# EAGLE design TouScruino-avr-ui2-v0 (EAGLE 6.3)
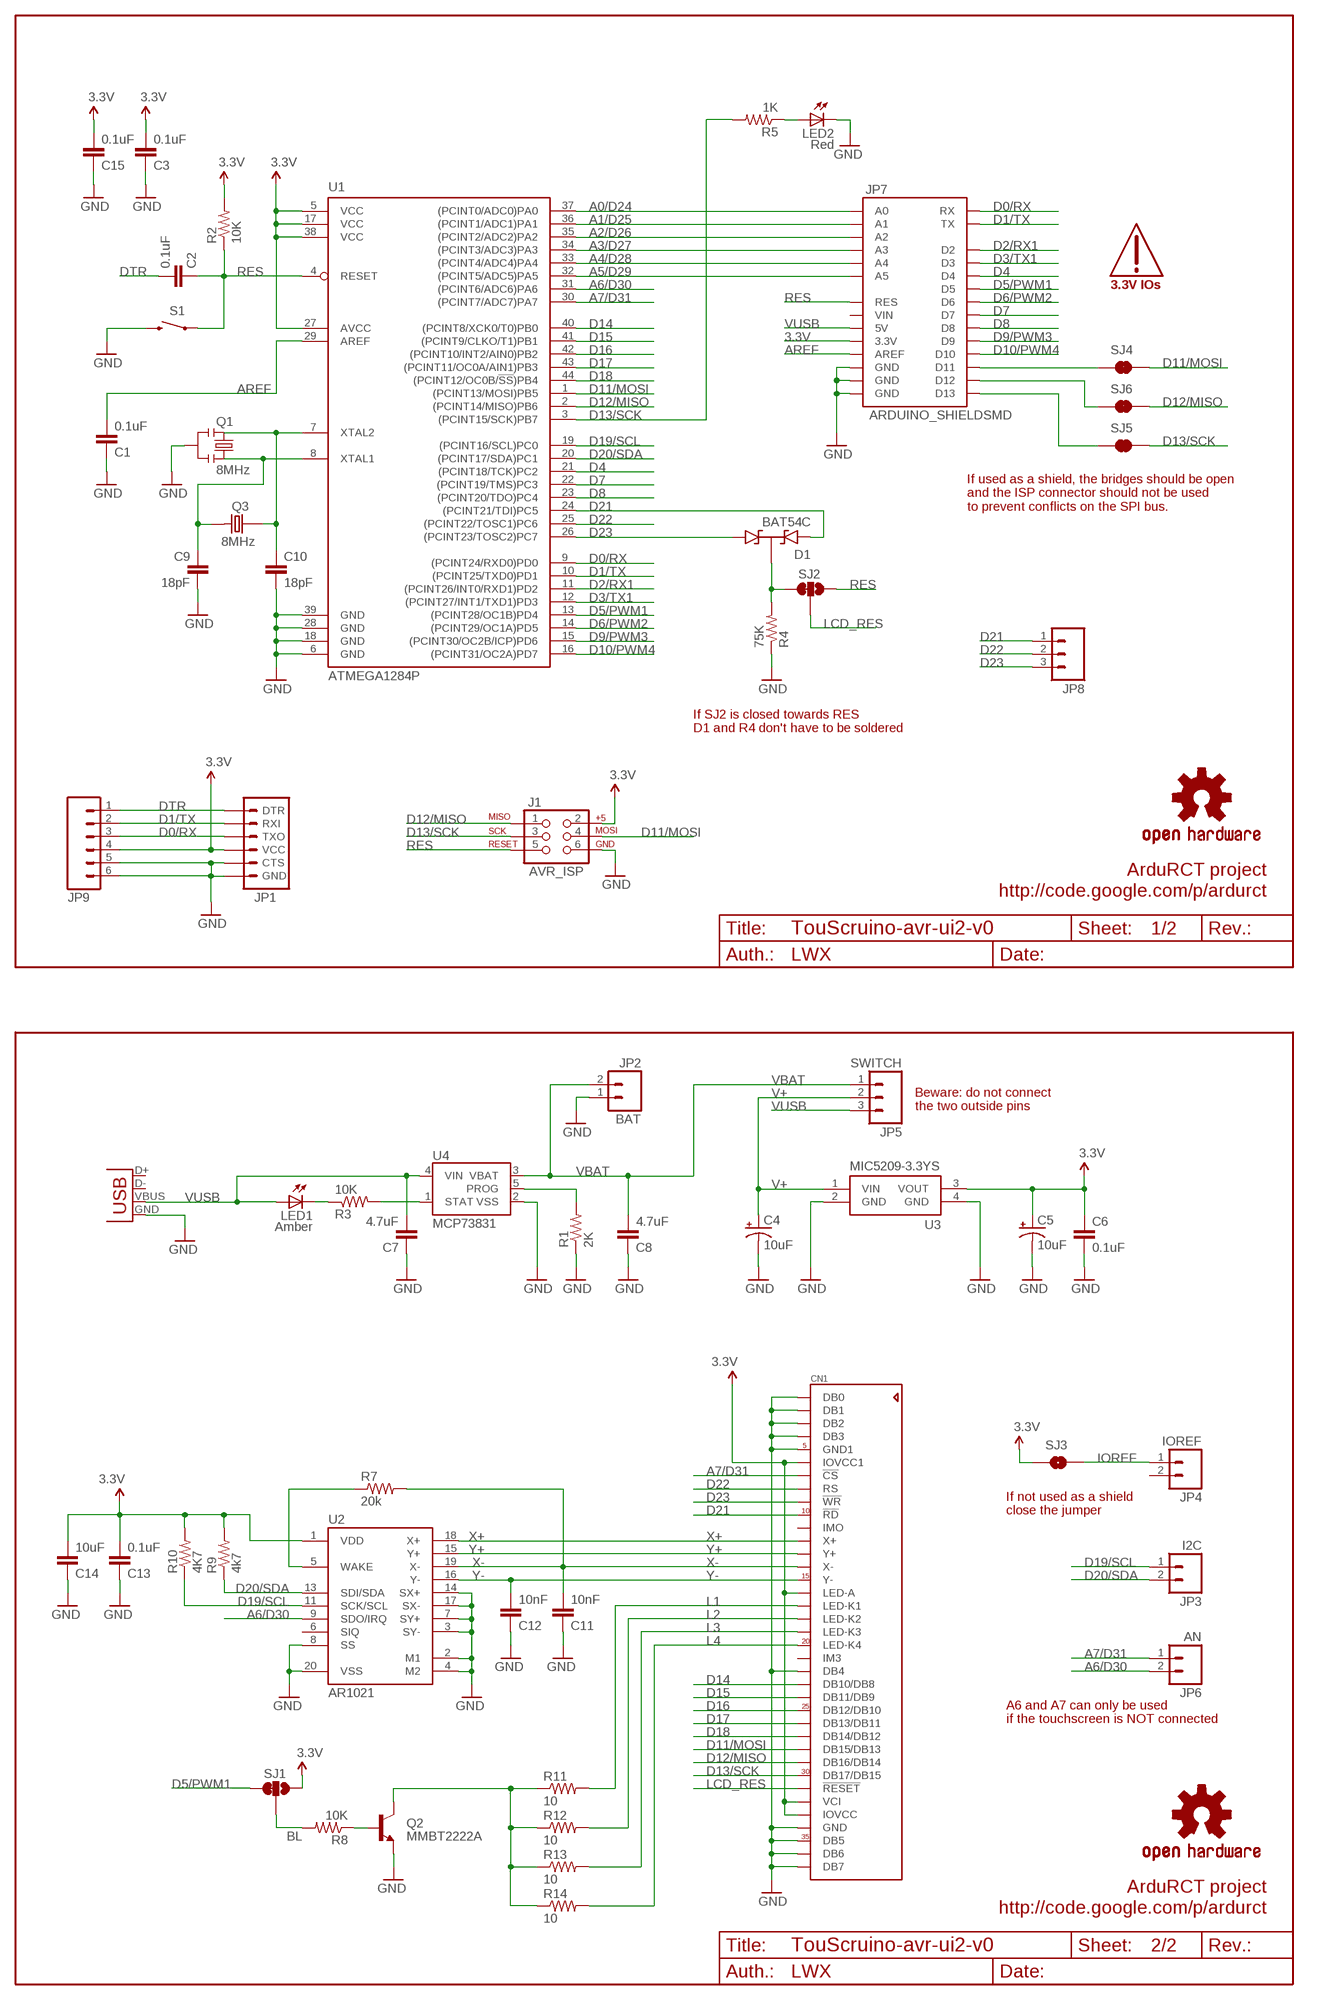
[diagram p0: schematic, sheet 1]

## Parts
C1  0.1uF  CAP0805  [0805]
C2  0.1uF  CAP0805  [0805]
C3  0.1uF  CAP0805  [0805]
C4  10uF  CAP_POL1206  [EIA3216]
C5  10uF  CAP_POL1206  [EIA3216]
C6  0.1uF  CAP0805  [0805]
C7  4.7uF  CAP0805  [0805]
C8  4.7uF  CAP0805  [0805]
C9  18pF  CAP0603-CAP  [0603-CAP]
C10  18pF  CAP0603-CAP  [0603-CAP]
C11  10nF  CAP0805  [0805]
C12  10nF  CAP0805  [0805]
C13  0.1uF  CAP0805  [0805]
C14  10uF  CAP0805  [0805]
C15  0.1uF  CAP0805  [0805]
CN1  ILI9325_LCD1.0MM  [ILI9325_28INCH_TS]
D1  BAT54C  [SOT23-3]
J1  AVR_ISP  AVR_SPI_PRG_6PTH  [2X3]
JP1  ARDUINO_SERIAL_PROGRAMPTH  [1X06]
JP2  BAT  M02-JST-2MM-SMT  [JST-2-SMD]
JP3  I2C  M02SMD2  [1X02_SMD]
JP4  IOREF  M02SMD2  [1X02_SMD]
JP5  SWITCH  M03SMD_TH  [1X03_SMD_TH]
JP6  AN  M02  [1X02]
JP7  ARDUINO_SHIELDSMD  [ARDUINO_SHIELD_SMD]
JP8  M03PTH  [1X03]
JP9  M06SMD  [1X06-SMD]
LED1  Amber  LED  [LED]
LED2  Red  LED  [LED]
Q1  8MHz  RESONATORSMD  [RESONATOR-SMD]
Q2  MMBT2222A  TRANSISTOR_NPNSOT23-3  [SOT23-3]
Q3  8MHz  CRYSTAL_5X3.2  [CRYSTAL_5X3.2]
R1  2K  RESISTOR0805-RES  [0805]
R2  10K  RESISTOR0805-RES  [0805]
R3  10K  RESISTOR0805-RES  [0805]
R4  75K  RESISTOR0805-RES  [0805]
R5  1K  RESISTOR0805-RES  [0805]
R7  20k  RESISTOR0805-RES  [0805]
R8  10K  RESISTOR0805-RES  [0805]
R9  4k7  RESISTOR0805-RES  [0805]
R10  4K7  RESISTOR0805-RES  [0805]
R11  10  RESISTOR0805-RES  [0805]
R12  10  RESISTOR0805-RES  [0805]
R13  10  RESISTOR0805-RES  [0805]
R14  10  RESISTOR0805-RES  [0805]
S1  SWITCH-MOMENTARY-2SMD  [TACTILE_SWITCH_SMD]
SJ1  SJ_2WAYS_1-2  [SJ_2WAYS_1-2_S]
SJ2  SJ_2WAYS_1-2  [SJ_2WAYS_1-2_S]
SJ3  SOLDERJUMPERNO  [SJ_2S-NO]
SJ4  SOLDERJUMPERTRACE  [SJ_2S-TRACE]
SJ5  SOLDERJUMPERTRACE  [SJ_2S-TRACE]
SJ6  SOLDERJUMPERTRACE  [SJ_2S-TRACE]
U1  ATMEGA1284P  ATMEGA324A  [TQFP44]
U2  AR1021  AR1020  [SSOP20]
U3  MIC5209-3.3YS  MIC5209  [SOT223]
U4  MCP73831  [SOT23-5]
U$3  OSHW-LOGOM  [OSHW-LOGO-M]
U$4  3.3V_IO  [3.3V_IO]
U$5  OSHW-LOGOM  [OSHW-LOGO-M]
X2  USB  [USB-MICROB]

## Nets
3.3V: C3.2 C5.A(+) C6.1 C13.2 C14.2 C15.2 CN1.6(IOVCC1) CN1.16(LED-A) CN1.32(VCI) CN1.33(IOVCC) J1.2 JP1.4(VCC) JP7.3.3V JP9.4 R2.2 R9.2 R10.2 SJ1.3 SJ3.1 U1.5(VCC) U1.17(VCC) U1.27(AVCC) U1.38(VCC) U2.1(VDD) U3.3(VOUT)
A0/D24: JP7.A0 U1.37((PCINT0/ADC0)PA0)
A1/D25: JP7.A1 U1.36((PCINT1/ADC1)PA1)
A2/D26: JP7.A2 U1.35((PCINT2/ADC2)PA2)
A3/D27: JP7.A3 U1.34((PCINT3/ADC3)PA3)
A4/D28: JP7.A4 U1.33((PCINT4/ADC4)PA4)
A5/D29: JP7.A5 U1.32((PCINT5/ADC5)PA5)
A6/D30: JP6.2 U1.31((PCINT6/ADC6)PA6) U2.9(SDO/IRQ)
A7/D31: CN1.7(!CS) JP6.1 U1.30((PCINT7/ADC7)PA7)
AREF: C1.2 JP7.AREF U1.29(AREF)
BL: R8.2 SJ1.2
D0/RX: JP1.3(TXO) JP7.RX JP9.3 U1.9((PCINT24/RXD0)PD0)
D1/TX: JP1.2(RXI) JP7.TX JP9.2 U1.10((PCINT25/TXD0)PD1)
D2/RX1: JP7.D2 U1.11((PCINT26/INT0/RXD1)PD2)
D3/TX1: JP7.D3 U1.12((PCINT27/INT1/TXD1)PD3)
D4: JP7.D4 U1.21((PCINT18/TCK)PC2)
D5/PWM1: JP7.D5 SJ1.1 U1.13((PCINT28/OC1B)PD4)
D6/PWM2: JP7.D6 U1.14((PCINT29/OC1A)PD5)
D7: JP7.D7 U1.22((PCINT19/TMS)PC3)
D8: JP7.D8 U1.23((PCINT20/TDO)PC4)
D9/PWM3: JP7.D9 U1.15((PCINT30/OC2B/ICP)PD6)
D10/PWM4: JP7.D10 U1.16((PCINT31/OC2A)PD7)
D11/MOSI: CN1.28(DB15/DB13) J1.4 SJ4.2 U1.1((PCINT13/MOSI)PB5)
D12/MISO: CN1.29(DB16/DB14) J1.1 SJ6.2 U1.2((PCINT14/MISO)PB6)
D13/SCK: CN1.30(DB17/DB15) J1.3 R5.2 SJ5.2 U1.3((PCINT15/SCK)PB7)
D14: CN1.23(DB10/DB8) U1.40((PCINT8/XCK0/T0)PB0)
D15: CN1.24(DB11/DB9) U1.41((PCINT9/CLKO/T1)PB1)
D16: CN1.25(DB12/DB10) U1.42((PCINT10/INT2/AIN0)PB2)
D17: CN1.26(DB13/DB11) U1.43((PCINT11/OC0A/AIN1)PB3)
D18: CN1.27(DB14/DB12) U1.44((PCINT12/OC0B/!SS!)PB4)
D19/SCL: JP3.1 R10.1 U1.19((PCINT16/SCL)PC0) U2.11(SCK/SCL)
D20/SDA: JP3.2 R9.1 U1.20((PCINT17/SDA)PC1) U2.13(SDI/SDA)
D21: CN1.10(!RD) D1.2(A2) JP8.1 U1.24((PCINT21/TDI)PC5)
D22: CN1.8(RS) JP8.2 U1.25((PCINT22/TOSC1)PC6)
D23: CN1.9(!WR) D1.1(A1) JP8.3 U1.26((PCINT23/TOSC2)PC7)
DTR: C2.2 JP1.1(DTR) JP9.1
GND [vcc]: C1.1 C3.1 C4.C(-) C5.C(-) C6.2 C7.1 C8.1 C9.2 C10.2 C11.1 C12.1 C13.1 C14.1 C15.1 CN1.1(DB0) CN1.2(DB1) CN1.3(DB2) CN1.4(DB3) CN1.5(GND1) CN1.22(DB4) CN1.34(GND) CN1.35(DB5) CN1.36(DB6) CN1.37(DB7) J1.6 JP1.5(CTS) JP1.6(GND) JP2.1 JP7.GND@0(GND) JP7.GND@1(GND) JP7.GND@2(GND) JP9.5 JP9.6 LED2.C1(C) Q1.2 Q2.2(E) R1.1 R4.1 S1.3 U1.6(GND) U1.18(GND) U1.28(GND) U1.39(GND) U2.2(M1) U2.3(SY-) U2.4(M2) U2.7(SY+) U2.8(SS) U2.14(SX+) U2.17(SX-) U2.20(VSS) U3.2(GND) U3.4(GND) U4.2(VSS) X2.GND
IOREF: JP4.1 SJ3.2
L1: CN1.17(LED-K1) R11.2
L2: CN1.18(LED-K2) R12.2
L3: CN1.19(LED-K3) R13.2
L4: CN1.20(LED-K4) R14.2
LCD_RES: CN1.31(!RESET) SJ2.2
N$1: C9.1 Q1.1 Q3.2 U1.8(XTAL1)
N$2: C10.1 Q1.3 Q3.1 U1.7(XTAL2)
N$3: JP7.D11 SJ4.1
N$4: Q2.1(B) R8.1
N$5: LED2.A1(A) R5.1
N$6: R7.1 U2.5(WAKE)
N$7: Q2.3(C) R11.1 R12.1 R13.1 R14.1
N$8: LED1.C1(C) R3.1
N$9: D1.3(K) R4.2 SJ2.1
N$10: JP7.D13 SJ5.1
N$12: R3.2 U4.1(STAT)
N$13: R1.2 U4.5(PROG)
N$14: JP7.D12 SJ6.1
RES: C2.1 J1.5 JP7.RES R2.1 S1.1 SJ2.3 U1.4(RESET)
V+: C4.A(+) JP5.2 U3.1(VIN)
VBAT: C8.2 JP2.2 JP5.1 U4.3(VBAT)
VUSB: C7.2 JP5.3 JP7.5V LED1.A1(A) U4.4(VIN) X2.VBUS
X+: CN1.12(X+) U2.18(X+)
X-: C11.2 CN1.14(X-) R7.2 U2.19(X-)
Y+: CN1.13(Y+) U2.15(Y+)
Y-: C12.2 CN1.15(Y-) U2.16(Y-)
Unconnected: CN1.11(IMO) CN1.21(IM3) JP4.2 JP7.VIN U2.6(SIQ) X2.D+ X2.D-

## Notes on the sheet
- If used as a shield, the bridges should be open
  and the ISP connector should not be used
  to prevent conflicts on the SPI bus.
- If SJ2 is closed towards RES
  D1 and R4 don't have to be soldered
- ArduRCT project
- http://code.google.com/p/ardurct
- 1/2
- LWX
- Beware: do not connect
  the two outside pins
- If not used as a shield
  close the jumper
- A6 and A7 can only be used
  if the touchscreen is NOT connected
- ArduRCT project
- http://code.google.com/p/ardurct
- 2/2
- LWX

## Library data of the parts
C1-C3 C6-C15 = SparkFun:CAP: Capacitor Standard 0603 ceramic capacitor, and 0.1" leaded capacitor.
C4 C5 = SparkFun:CAP_POL: Capacitor Polarized These are standard SMD and PTH capacitors. Normally 10uF, 47uF, and 100uF in electrolytic and tantalum varieties. Always verify the external diameter of the through hole cap, it varies with capacity, voltage, and manufacturer. The EIA devices should be standard.
CN1 = adafruit:ILI9325_LCD: 2.8" ILI9325-based TFT LCD w/Integrated Touch Screen
D1 = wibauxl:BAT54C
J1 = SparkFun:AVR_SPI_PRG_6: AVR ISP 6 Pin This is the reduced ISP connector for AVR programming. Common on Arduino. This footprint will take up less PCB space and can be used with a 10-pin to 6-pin adapter such as SKU: BOB-08508
JP1 = SparkFun:ARDUINO_SERIAL_PROGRAM
JP2 = SparkFun:M02: Header 2 Standard 2-pin 0.1" header. Use with straight break away headers (SKU : PRT-00116), right angle break away headers (PRT-00553), swiss pins (PRT-00743), machine pins (PRT-00117), and female headers (PRT-00115). Molex polarized connector foot print use with SKU : PRT-08233 with associated crimp pins and housings.
JP3 JP4 JP6 = wibauxl:M02
JP5 = wibauxl:M03
JP7 = wibauxl:ARDUINO_SHIELD
JP8 = SparkFun:M03: Header 3 Standard 3-pin 0.1" header. Use with straight break away headers (SKU : PRT-00116), right angle break away headers (PRT-00553), swiss pins (PRT-00743), machine pins (PRT-00117), and female headers (PRT-00115). Molex polarized connector foot print use with SKU : PRT-08232 with associated crimp pins and housings.
JP9 = wibauxl:M06
LED1 LED2 = wibauxl:LED
Q1 = SparkFun:RESONATOR: Resonator Small SMD resonator. This is the itty bitty 10/20MHz resonators with built in caps. CSTCE10M0G55 and CSTCE20M0V53. Footprint has been reviewed closely but hasn't been tested yet.
Q2 = SparkFun:TRANSISTOR_NPN: Transistor NPN BJT configuration in SOT23 package. MMBT2222 is the common NPN we use. Double check BCE configuration again layout.
Q3 = wibauxl:CRYSTAL_5X3.2
R1-R5 R7-R14 = SparkFun:RESISTOR: Resistor Basic schematic elements and footprints for 0603, 1206, and PTH resistors.
S1 = SparkFun:SWITCH-MOMENTARY-2
SJ1 SJ2 = wibauxl:SJ_2WAYS_1-2
SJ3-SJ6 = SparkFun:SOLDERJUMPER: Solder Jumper Standard SMD solder jumper. Used to automate production. Two varients : Normally Open and Normally Closed are the same, but have different paste layers. NC will have a large amount of paste and should jumper during reflow.
U1 = wibauxl:ATMEGA324: 8-bit Microcontroller with 64K Bytes In-System Programmable Flash Source: http://www.atmel.com/dyn/resources/prod_documents/doc2593.pdf
U2 = wibauxl:AR1020
U3 = wibauxl:MIC5209
U4 = SparkFun:MCP73831: Microchip's MCP73831 Miniature single cell, fully integrated Li-Ion, Li-polymer charge management controller http://ww1.microchip.com/downloads/en/DeviceDoc/21984a.pdf
U$3 U$5 = SparkFun:OSHW-LOGO: Open Source Hardware Logo This logo indicates the piece of hardware it is found on incorporates a OSHW license and/or adheres to the definition of open source hardware found here: http://freedomdefined.org/OSHW
U$4 = wibauxl:3.3V_IO
X2 = wibauxl:USB

## Net classes
0 default: width 0.203 mm
1 vcc: width 0.254 mm

## Board
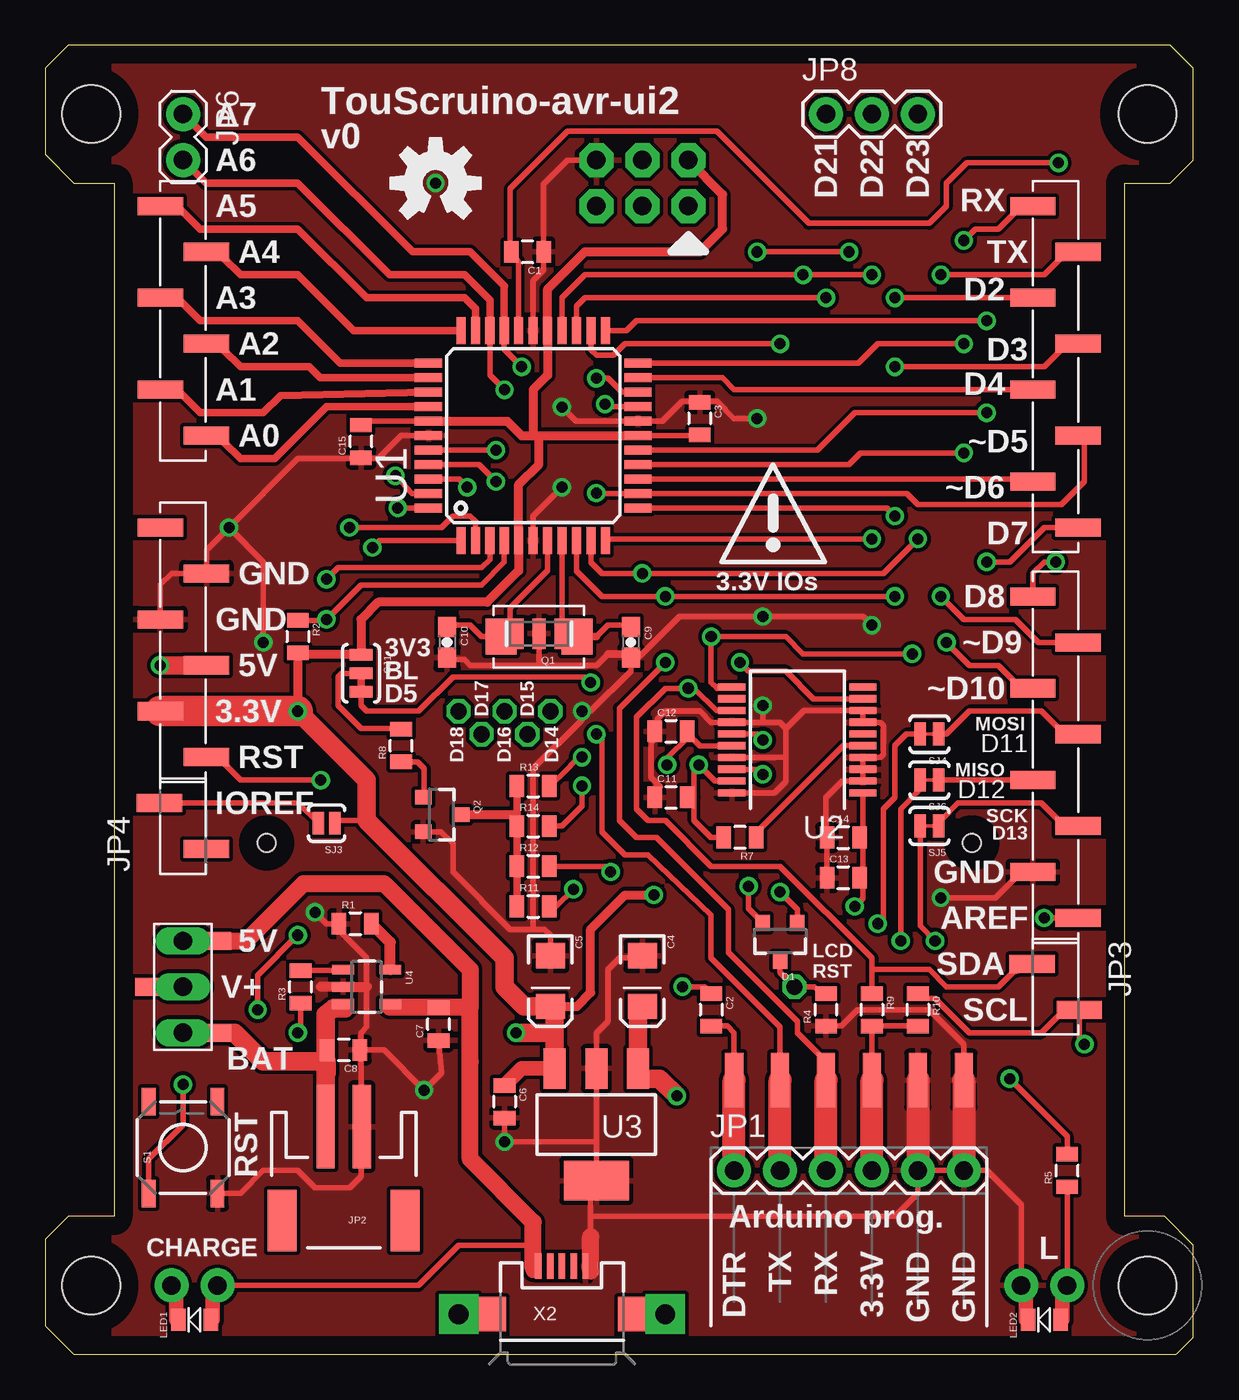
[diagram p1: board, top side]
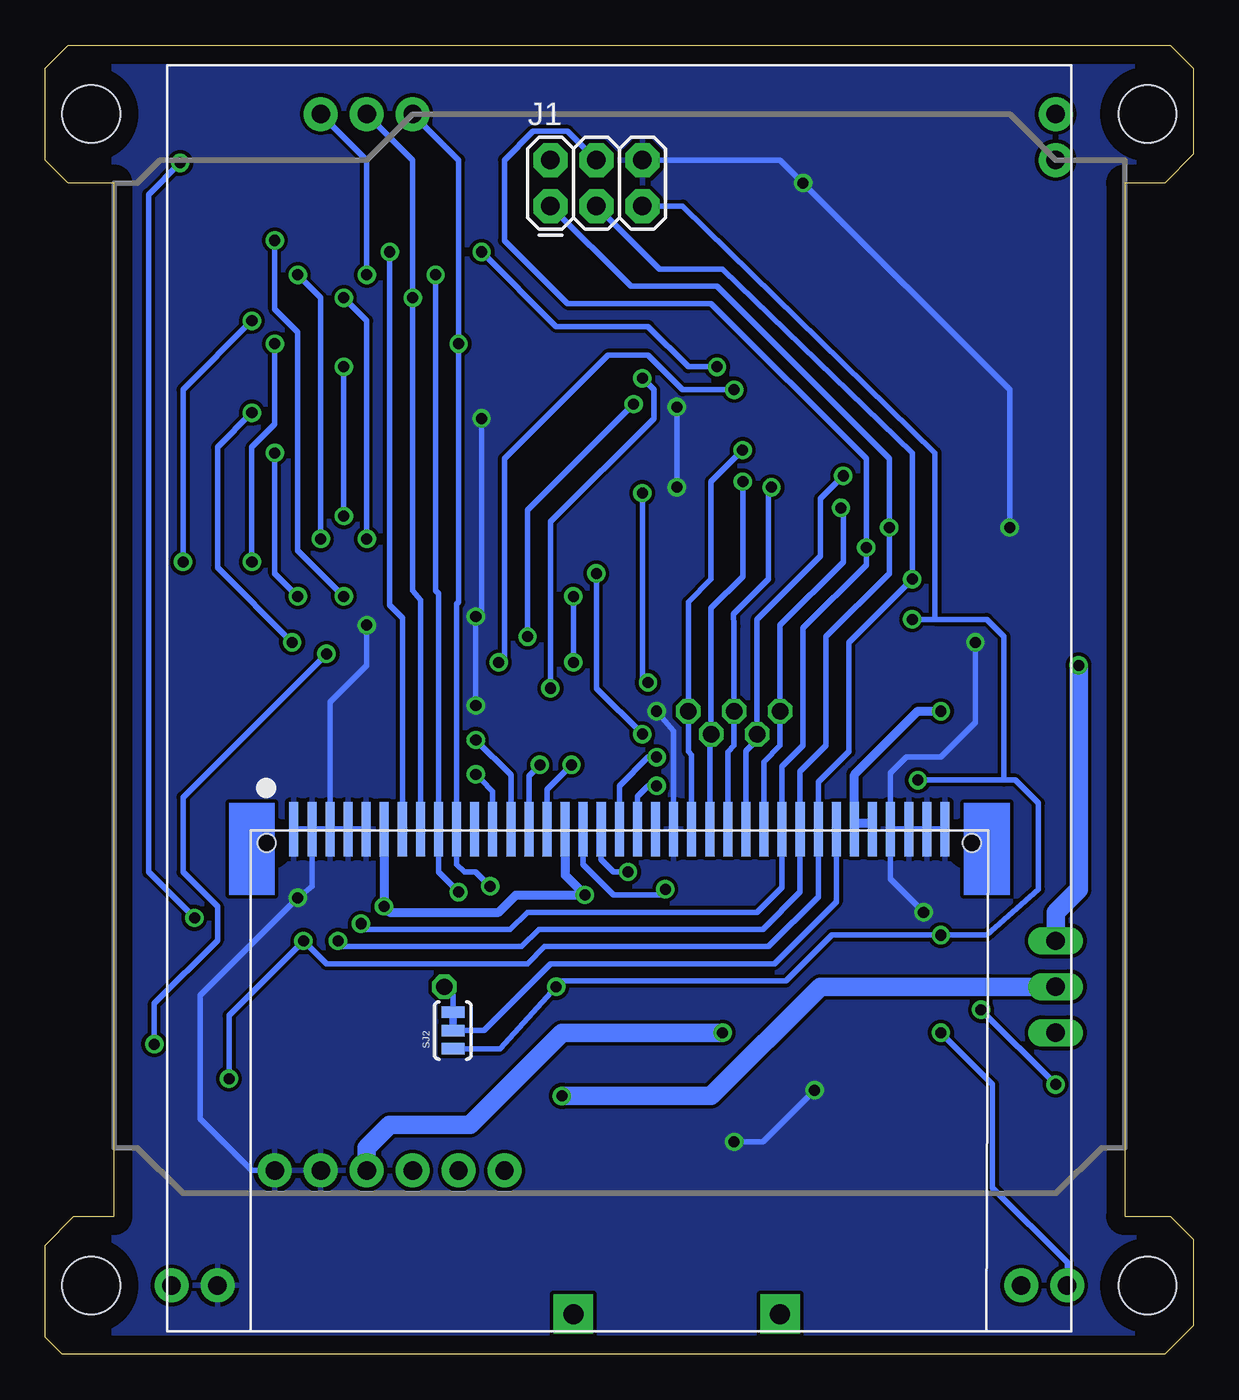
[diagram p2: board, bottom side, seen from below]

Size 63.5 x 72.39 mm. Coordinates in mm from the lower left corner, seen from the top.
Outline: 63.5,0.95 63.5,6.03 61.91,7.62 59.69,7.62 59.69,64.77 62.23,64.77 63.5,66.04 63.5,71.12 62.23,72.39 1.27,72.39 0,71.12 0,66.36 1.59,64.77 1.91,64.77 3.81,64.77 3.81,7.62 1.27,7.62 0,6.35 0,1.59 1.59,0 62.55,0 63.5,0.95
Copper layers (1*16): Top 0.035mm / dielectric 1.5mm / Bottom 0.035mm
Design rules "default *": minimum track width 10mil, minimum drill 24mil, track to track 8mil, track to pad 8mil, pad to pad 8mil, via to via 8mil, smd to smd 8mil, copper to edge 40mil, drill to drill 8mil, minimum pad ring 10mil, minimum via ring 8mil, stop-mask expansion 4mil, vias tented up to drill 0mil, thermal gap 10mil
Holes 3.2 mm at 2.54,68.58 60.96,68.58 2.54,3.81 60.96,3.81

### Footprints (pad centres in the part's own frame; a part is rotated, then mirrored left to right if it is on the bottom)
0805 = smd 0.8 x 1.2: 1 -0.9,0; 2 0.9,0
EIA3216 = smd 1.4 x 1.6: A 1.4,0; C -1.4,0
0603-CAP = smd 1.1 x 1: 1 -0.85,0; 2 0.85,0
ILI9325_28INCH_TS = smd 0.5 x 3: 1 -18,27.77; 2 -17,27.77; 3 -16,27.77; 4 -15,27.77; 5 -14,27.77; 6 -13,27.77; 7 -12,27.77; 8 -11,27.77; 9 -10,27.77; 10 -9,27.77; 11 -8,27.77; 12 -7,27.77; 13 -6,27.77; 14 -5,27.77; 15 -4,27.77; 16 -3,27.77; 17 -2,27.77; 18 -1,27.77; 19 0,27.77; 20 1,27.77; 21 2,27.77; 22 3,27.77; 23 4,27.77; 24 5,27.77; 25 6,27.77; 26 7,27.77; 27 8,27.77; 28 9,27.77; 29 10,27.77; 30 11,27.77; 31 12,27.77; 32 13,27.77; 33 14,27.77; 34 15,27.77; 35 16,27.77; 36 17,27.77; 37 18,27.77 | hole 1: -19.5,27; 19.5,27
SOT23-3 = smd 0.8 x 0.9: 1 -0.95,-1; 2 0.95,-1; 3 0,1.1
2X3 = drill 1.016 pad 1.88 octagon: 1 0,0; 2 0,2.54; 3 2.54,0; 4 2.54,2.54; 5 5.08,0; 6 5.08,2.54
1X06 = drill 1.016 pad 1.88: 1 0,0; 2 2.54,0; 3 5.08,0; 4 7.62,0; 5 10.16,0; 6 12.7,0
JST-2-SMD = smd 1 x 4.6: 1 -1,-3.7; 2 1,-3.7 | smd 1.6 x 3.4: NC1 -3.4,1.5; NC2 3.4,1.5
1X02_SMD = smd 1 x 2.5: 1 0,1.3; 2 -2.54,-1.3
1X03_SMD_TH = drill 1.016 pad 1.245 long: 1 0,0; 2 -2.54,0; 3 -5.08,0 | smd 1 x 2: 1A 0,1.651; 2A -2.54,-1.651; 3A -5.08,1.651
1X02 = drill 1.016 pad 1.88: 1 0,0; 2 2.54,0
ARDUINO_SHIELD_SMD = smd 1 x 2.5 bottom: 3.3V 33.02,52.05; 5V 30.48,49.5; A0 17.78,49.5; A1 15.24,52.05; A2 12.7,49.5; A3 10.16,52.05; A4 7.62,49.5; A5 5.08,52.05; AREF 44.45,1.3; D2 10.16,3.8; D3 12.7,1.3; D4 15.24,3.8; D5 17.78,1.3; D6 20.32,3.8; D7 22.86,1.3; D8 26.67,3.8; D9 29.21,1.3; D10 31.75,3.8; D11 34.29,1.3; D12 36.83,3.8; D13 39.37,1.3; GND@0 27.94,52.05; GND@1 25.4,49.5; GND@2 41.91,3.8; RES 35.56,49.5; RX 5.08,3.8; TX 7.62,1.3; VIN 22.86,52.05
1X03 = drill 1.016 pad 1.88: 1 0,0; 2 2.54,0; 3 5.08,0
1X06-SMD = smd 1 x 3: 1 -6.35,5; 2 -3.81,5; 3 -1.27,5; 4 1.27,5; 5 3.81,5; 6 6.35,5
LED = smd 0.8 x 1.2: A -0.9,0; C 0.9,0 | drill 1.016 pad 1.88: A1 -1.27,-1.905; C1 1.27,-1.905
RESONATOR-SMD = smd 0.7 x 1.7: 1 -1.2,0; 2 0,0; 3 1.2,0
CRYSTAL_5X3.2 = smd 1.7 x 2: 1 2.1,0; 2 -2.1,0
TACTILE_SWITCH_SMD = smd 1.524 x 0.762: 1 -2.54,1.905; 2 2.54,1.905; 3 -2.54,-1.905; 4 2.54,-1.905
SJ_2WAYS_1-2_S = smd 0.635 x 1.27: 1 0.508,0; 2 -0.508,0; 3 -1.524,0
SJ_2S-NO = smd 0.635 x 1.27: 1 -0.45,0; 2 0.45,0
SJ_2S-TRACE = smd 0.635 x 1.27: 1 -0.508,0; 2 0.508,0
TQFP44 = smd 1.5 x 0.5: 1 -5.8,4; 2 -5.8,3.2; 3 -5.8,2.4; 4 -5.8,1.6; 5 -5.8,0.8; 6 -5.8,0; 7 -5.8,-0.8; 8 -5.8,-1.6; 9 -5.8,-2.4; 10 -5.8,-3.2; 11 -5.8,-4; 23 5.8,-4; 24 5.8,-3.2; 25 5.8,-2.4; 26 5.8,-1.6; 27 5.8,-0.8; 28 5.8,0; 29 5.8,0.8; 30 5.8,1.6; 31 5.8,2.4; 32 5.8,3.2; 33 5.8,4 | smd 0.5 x 1.5: 12 -4,-5.8; 13 -3.2,-5.8; 14 -2.4,-5.8; 15 -1.6,-5.8; 16 -0.8,-5.8; 17 0,-5.8; 18 0.8,-5.8; 19 1.6,-5.8; 20 2.4,-5.8; 21 3.2,-5.8; 22 4,-5.8; 34 4,5.8; 35 3.2,5.8; 36 2.4,5.8; 37 1.6,5.8; 38 0.8,5.8; 39 0,5.8; 40 -0.8,5.8; 41 -1.6,5.8; 42 -2.4,5.8; 43 -3.2,5.8; 44 -4,5.8
SSOP20 = smd 0.4 x 1.5: 1 -2.925,-3.625; 2 -2.275,-3.625; 3 -1.625,-3.625; 4 -0.975,-3.625; 5 -0.325,-3.625; 6 0.325,-3.625; 7 0.975,-3.625; 8 1.625,-3.625; 9 2.275,-3.625; 10 2.925,-3.625; 11 2.925,3.625; 12 2.275,3.625; 13 1.625,3.625; 14 0.975,3.625; 15 0.325,3.625; 16 -0.325,3.625; 17 -0.975,3.625; 18 -1.625,3.625; 19 -2.275,3.625; 20 -2.925,3.625
SOT223 = smd 1.219 x 2.235: 1 -2.311,-3.099; 2 0,-3.099; 3 2.311,-3.099 | smd 3.6 x 2.2: 4 0,3.099
SOT23-5 = smd 0.55 x 1.2: 1 -0.95,-1.3; 2 0,-1.3; 3 0.95,-1.3; 4 0.95,1.3; 5 -0.95,1.3
USB-MICROB = smd 0.35 x 1.4: D+ 0,2.65; D- -0.65,2.65; GND 1.3,2.65; ID 0.65,2.65; VBUS -1.3,2.65 | smd 1.8 x 1.9: MT1 -4,0; MT2 4,0 | drill 1.1 pad 2.184 square: MT1A -5.715,0; MT2A 5.715,0

### Placement (x,y rotation side)
C1  26.67,60.96 180 top
C2  36.83,19.05 270 top
C3  36.2,51.75 270 top
C4  33.02,20.64 270 top
C5  27.94,20.64 270 top
C6  25.4,13.97 270 top
C7  21.75,18.26 90 top
C8  16.51,16.83 180 top
C9  32.38,39.37 270 top
C10  22.23,39.37 270 top
C11  34.61,30.8 0 top
C12  34.61,34.45 0 top
C13  44.13,26.35 0 top
C14  44.13,28.57 0 top
C15  17.46,50.48 90 top
CN1  31.75,1.27 0 bottom
D1  40.64,22.86 180 top
J1  35.56,63.5 0 bottom
JP1  38.1,10.16 0 top
JP2  16.51,8.89 180 top
JP3  55.88,19.05 270 top
JP4  7.62,30.48 90 top
JP5  7.62,17.78 270 top
JP6  7.62,68.58 270 top
JP7  58.42,68.58 270 bottom
JP8  43.18,68.58 0 top
JP9  44.45,10.16 0 top
LED1  8.26,1.91 180 top
LED2  55.24,1.91 180 top
Q1  27.3,39.85 180 top
Q2  21.91,29.84 270 top
Q3  27.3,39.69 180 top
R1  17.14,23.81 0 top
R2  13.97,39.69 270 top
R3  14.13,20.32 90 top
R4  43.18,19.05 90 top
R5  56.52,10.16 90 top
R7  38.42,28.57 180 top
R8  19.68,33.66 90 top
R9  45.72,19.05 270 top
R10  48.26,19.05 270 top
R11  26.99,24.77 0 top
R12  26.99,26.99 0 top
R13  26.99,31.43 0 top
R14  26.99,29.21 0 top
S1  7.62,11.43 90 top
SJ1  17.46,37.15 270 top
SJ2  40.96,18.41 90 bottom
SJ3  15.56,29.37 180 top
SJ4  48.9,34.29 180 top
SJ5  48.9,29.21 180 top
SJ6  48.9,31.75 180 top
U1  26.99,50.8 90 top
U2  41.59,33.97 90 top
U3  30.48,12.7 180 top
U4  17.78,20.32 270 top
U$3  21.59,64.77 0 top
U$4  40.26,45.4 0 top
U$5  21.59,64.77 0 top
X2  28.57,2.22 0 top

### Tracks (layer width: path | path; a pad name or v marks a point on that pad's centre or on a via)
3.3V  (via drill 0.61)
  Top 0.305: R10.2 R9.2 JP9.4 | U2.1 45.22,28.57 | 45.22,28.57 45.22,26.35 | 45.22,26.35 45.22,25.21 v44.77,24.77 | 27.94,19.05 28.26,19.05 28.13,19.18 C5.A 28.17,19.01 | C14.2 45.22,28.57 | C13.2 45.22,26.35 | 17.78,29.53 16.17,29.53 SJ3.1 | U1.38 17.68,51.6 C15.2 | U1.17 36.46,50.8 C3.2
  Top 0.508: U1.38 25.55,51.6 26.35,50.8 26.99,50.8 | 26.99,50.8 27.3,50.8 | 27.3,50.8 27.94,50.8 | 27.94,50.8 U1.17 | 26.99,50.8 26.99,53.34 27.79,54.14 U1.27 27.79,58.9 29.84,60.96 36.2,60.96 37.47,62.23 37.47,64.14 J1.2 | 26.99,50.8 26.99,50.79 27.94,50.8 | 27.3,50.8 27.3,49.21 26.19,48.09 U1.5 26.19,43.33 24.45,41.59 18.41,41.59 17.46,40.64 SJ1.3 17.4,38.73 13.71,38.73 R2.2 v13.97,35.56 | C5.A 29.4,19.24 30.16,20 30.16,23.5 32.07,25.4 v33.66,25.4
  Top 0.813: U3.3 26.33,15.8 C6.1
  Top 1.016: U3.3 28.17,17.78 | 28.17,17.78 28.17,19.01 | v13.97,35.56 17.78,31.75 17.78,29.53 25.4,21.91 25.4,20.32 26.48,19.24 C5.A | v26.04,17.78 28.17,17.78
  Top 1.27: JP1.4 JP9.4
  Top 1.676: JP7.3.3V v13.97,35.56
  Bottom 0.305: v33.66,25.4 34.75,26.53 34.75,26.5 | 44.75,24.78 v44.77,24.77
  Bottom 0.508: CN1.16 34.75,26.53 | CN1.6 44.75,24.78 44.75,24.75 44.45,24.45 38.42,24.45 37.47,25.4 v33.66,25.4 34.75,26.5 | CN1.33 17.75,29.36 18.75,29.36 | v13.97,35.56 15.24,35.56 18.75,32.05 18.75,29.36 | 18.75,29.36 CN1.32
  Bottom 1.016: v26.04,17.78 34.92,17.78 40.01,12.7 44.45,12.7 45.72,11.43 JP1.4
A0/D24
  Top 0.406: U1.37 15.57,52.4 12.7,49.53 10.79,49.53 9.87,50.45 JP7.A0
A1/D25
  Top 0.406: U1.36 13.02,53.02 12.06,52.07 8.57,52.07 7.3,53.34 7.16,53.2 6.11,53.2 JP7.A1
A2/D26
  Top 0.406: U1.35 15.21,54 14.61,54.61 10.79,54.61 9.87,55.53 JP7.A2
A3/D27
  Top 0.406: U1.34 16.32,54.8 13.97,57.15 8.57,57.15 7.3,58.42 JP7.A3
A4/D28
  Top 0.406: U1.33 17.06,56.6 13.97,59.69 10.79,59.69 9.84,60.64 JP7.A4
A5/D29
  Top 0.406: U1.32 23.79,57.81 23.18,58.42 17.78,58.42 13.97,62.23 8.57,62.23 7.3,63.5 JP7.A5
A6/D30  (via drill 0.61)
  Top 0.305: U2.9 42.49,36.25 40.96,37.78 38.89,37.78 v38.42,38.26 | v25.4,53.34 24.59,54.15 U1.31
  Top 0.406: U1.31 24.59,58.28 23.18,59.69 19.05,59.69 13.97,64.77 8.89,64.77 JP6.2
  Bottom 0.305: v38.42,38.26 38.1,38.58 38.1,49.53 32.38,55.24 30.16,55.24 28.26,53.34 v25.4,53.34
A7/D31  (via drill 0.61)
  Top 0.305: v26.35,54.61 25.39,55.58 U1.30 | v39.37,60.96 v44.45,60.96
  Top 0.406: U1.30 25.39,59.04 25.4,59.05 23.5,60.96 20.32,60.96 13.97,67.31 8.89,67.31 JP6.1
  Bottom 0.305: CN1.7 43.75,40.7 44.45,41.43 v44.45,60.96 | v26.35,54.61 27.94,54.61 30.16,56.83 35.24,56.83 v39.37,60.96
AREF  (via drill 0.61)
  Top 0.305: U1.29 26.19,60.42 C1.2 25.72,60.7 25.72,64.45 28.89,67.63 37.15,67.63 42.23,62.55 48.9,62.55 49.85,63.5 49.85,64.77 50.96,65.88 v56.04,65.88 | 57.78,24.13 JP7.AREF v55.24,24.13
  Bottom 0.305: v55.24,24.13 57.78,26.67 57.78,64.14 v56.04,65.88
BL
  Top 0.305: SJ1.2 16.38,37.66 16.19,37.47 16.19,35.88 17.46,34.61 19.95,34.61 R8.2
D0/RX  (via drill 0.61)
  Top 0.305: U1.9 29.39,43.32 30.8,41.91 v34.29,41.91 v46.99,41.91 | v34.29,38.26 31.75,35.72 31.75,29.53 32.7,28.57 33.81,28.57 37.78,24.61 37.78,22.23 41.59,18.41 41.59,17.78 43.18,16.19 JP9.3 | v50.8,61.59 51.44,62.23 52.7,62.23 53.98,63.5 JP7.RX
  Top 1.27: JP1.3 JP9.3
  Bottom 0.305: v34.29,41.91 v34.29,38.26 | v46.99,41.91 49.53,44.45 49.53,56.52 50.8,57.78 v50.8,61.59
D1/TX  (via drill 0.61)
  Top 0.305: U1.10 30.19,43.79 30.8,43.18 v33.02,43.18 46.35,43.18 v48.26,45.09 | v30.48,34.29 30.8,33.97 30.8,28.89 32.07,27.62 33.34,27.62 36.83,24.29 36.83,21.91 40.64,18.1 JP9.2 | v49.53,59.69 55.24,59.69 56.52,60.96 JP7.TX
  Top 1.27: JP1.2 JP9.2
  Bottom 0.305: v30.48,34.29 33.02,36.83 v33.02,43.18 | v48.26,45.09 48.26,58.42 v49.53,59.69
D2/RX1  (via drill 0.61)
  Top 0.305: U1.11 30.88,45 31.11,45.09 v45.72,45.09 | v46.99,58.42 JP7.D2
  Bottom 0.305: v45.72,45.09 45.72,57.15 v46.99,58.42
D3/TX1  (via drill 0.61)
  Top 0.305: U1.12 46.55,46.8 v46.99,46.35 | v46.99,54.61 55.24,54.61 56.52,55.88 JP7.D3
  Bottom 0.305: v46.99,46.35 v46.99,54.61
D4
  Top 0.305: JP7.D4 38.1,53.34 37.44,54 U1.21
D5/PWM1  (via drill 0.61)
  Top 0.305: JP7.D5 57.47,50.74 57.47,48.26 56.2,46.99 48.26,46.99 47.65,47.6 U1.13 30.5,47.6 v30.48,47.62 | v30.16,37.15 29.84,37.47 22.54,37.47 20.64,35.56 17.78,35.56 17.46,35.88 SJ1.1
  Bottom 0.305: v30.16,37.15 30.48,37.47 v30.48,47.62
D6/PWM2
  Top 0.305: U1.14 54.09,48.4 JP7.D6
D7  (via drill 0.61)
  Top 0.305: JP7.D7 55.24,45.72 53.34,43.81 v52.07,43.81 | v50.8,55.88 46.04,55.88 44.96,54.8 U1.22
  Bottom 0.305: v52.07,43.81 52.07,50.16 50.8,51.44 v50.8,55.88
D8  (via drill 0.61)
  Top 0.305: U1.23 32.15,56.6 32.7,57.15 v52.07,57.15 | JP7.D8 54.62,43.19 55.24,43.81 v55.88,43.81
  Bottom 0.305: v52.07,57.15 55.88,53.34 v55.88,43.81
D9/PWM3  (via drill 0.61)
  Top 0.305: U1.15 43.17,49.2 | 43.17,49.2 43.18,49.21 | 43.17,49.2 44.44,49.2 45.09,49.85 v50.8,49.85 | v49.53,41.91 50.8,40.64 53.66,40.64 54.93,39.37 JP7.D9
  Bottom 0.305: v49.53,41.91 50.8,43.18 v50.8,49.85
D10/PWM4  (via drill 0.61)
  Top 0.305: U1.16 42.7,50 44.77,52.07 v52.07,52.07 | v49.85,39.37 51.12,38.1 52.7,38.1 53.82,36.99 JP7.D10
  Bottom 0.305: v52.07,52.07 53.98,50.16 53.98,43.5 v49.85,39.37
D11/MOSI  (via drill 0.61)
  Top 0.305: SJ4.2 47.62,34.29 46.99,33.66 46.99,30.8 46.35,30.16 46.35,24.13 v46.04,23.81 | U1.1 18.5,45 v18.1,44.61
  Bottom 0.305: v46.04,23.81 45.72,23.5 37.78,23.5 36.83,24.45 24.13,24.45 22.75,25.83 CN1.28 22.75,32.49 21.59,33.66 21.59,40.16 18.1,43.66 v18.1,44.61 18.1,49.53 26.67,58.1 34.61,58.1 38.1,61.59 38.1,66.04 36.51,67.63 34.61,67.63 J1.4
D12/MISO  (via drill 0.61)
  Top 0.305: SJ6.2 48.26,31.11 47.31,30.16 v47.31,22.86 | U1.2 23.79,46.06 23.5,46.35 22.54,46.35 21.91,45.72 v16.83,45.72
  Bottom 0.305: v47.31,22.86 46.99,22.54 37.15,22.54 36.2,23.5 23.81,23.5 21.75,25.56 CN1.29 21.75,32.23 20.32,33.66 20.32,39.69 16.83,43.18 v16.83,45.72 16.83,49.53 26.35,59.05 31.11,59.05 J1.1
D13/SCK  (via drill 0.61)
  Top 0.305: SJ5.2 48.39,23.69 v49.21,22.86 | U1.3 24.59,43.95 24.13,43.5 16.19,43.5 v15.56,42.86 | v53.34,15.24 56.52,12.06 R5.2
  Bottom 0.305: v53.34,15.24 53.34,18.73 v49.21,22.86 47.94,21.59 36.83,21.59 35.88,22.54 23.5,22.54 20.75,25.29 CN1.30 20.75,31.64 19.05,33.34 19.05,39.37 v15.56,42.86 15.56,49.85 26.04,60.01 29.53,60.01 J1.3
D14  (via drill 0.61, 0.9)
  Top 0.305: U1.40 v24.93,50
  Bottom 0.305: v24.93,50 26.67,48.26 26.67,42.86 27.94,41.59 v27.94,35.56 27.94,33.34 27.75,33.15 CN1.23
D15  (via drill 0.61, 0.9)
  Top 0.305: U1.41 23.98,49.2 v24.92,48.26
  Bottom 0.305: v24.92,48.26 24.92,43.02 26.67,41.27 v26.67,34.29 26.75,34.37 CN1.24
D16  (via drill 0.61, 0.9)
  Top 0.305: U1.42 22.88,48.4 v23.34,47.94
  Bottom 0.305: v23.34,47.94 23.5,47.78 23.5,42.86 25.43,40.92 25.4,40.26 v25.4,35.56 25.4,33.66 25.75,33.3 CN1.25
D17  (via drill 0.61, 0.9)
  Top 0.305: U1.43 20.3,47.6 v19.37,48.58
  Bottom 0.305: v19.37,48.58 20.64,47.31 20.64,44.13 24.13,40.64 v24.13,34.29 24.13,33.97 24.75,33.35 CN1.26
D18  (via drill 0.61, 0.9)
  Top 0.305: U1.44 v19.5,46.8
  Bottom 0.305: v19.5,46.8 19.37,46.67 19.37,43.81 22.86,40.32 v22.86,35.56 22.86,33.66 23.75,32.77 CN1.27
D19/SCL  (via drill 0.61)
  Top 0.305: 37.08,36.9 U2.11 37.22,36.9 37.15,36.83 37.08,36.9 | 37.08,36.9 36.83,37.15 v36.83,39.69 40.96,39.69 41.91,38.73 v47.94,38.73 | U1.19 31.13,52.4 v30.96,52.55 | 48.58,20 R10.1 48.52,19.68 49.21,19.68 51.12,17.78 55.09,17.78 56.36,19.05 JP3.1 57.18,17.49 v57.47,17.14
  Bottom 0.305: v36.83,39.69 36.83,46.67 v30.96,52.55 | v47.94,38.73 55.88,30.8 55.88,26.67 53.98,24.77 53.98,22.89 57.47,19.4 v57.47,17.14
D20/SDA  (via drill 0.61)
  Top 0.305: JP3.2 54.61,21.43 53.5,21.11 52.7,20.32 49.85,20.32 48.9,21.27 45.72,21.27 45.72,20.32 | 45.72,20.32 R9.1 | 45.72,20.32 45.72,21.91 40.64,26.99 36.83,26.99 34.29,29.53 33.34,29.53 32.7,30.16 32.7,35.24 34.29,36.83 v35.56,36.83 35.88,36.83 37.11,35.6 U2.13 | U1.20 31.89,53.2 31.11,53.98 v30.48,53.98
  Bottom 0.305: v35.56,36.83 35.56,46.04 29.84,51.75 29.84,53.34 v30.48,53.98
D21  (via drill 0.61)
  Top 0.305: U1.24 30.19,55.54 30.48,55.24 31.43,55.24 32.07,55.88 v40.64,55.88 | v38.89,25.88 38.89,24.66 D1.2
  Bottom 0.305: JP8.1 40.64,66.04 v40.64,55.88 40.64,41.59 40.75,41.48 CN1.10 40.75,27.1 40.32,26.67 39.69,26.67 v38.89,25.88
D22  (via drill 0.61)
  Top 0.305: U1.25 29.39,57.96 29.84,58.42 v43.18,58.42
  Bottom 0.305: CN1.8 42.75,41.7 43.18,42.23 v43.18,58.42 43.18,66.04 JP8.2
D23  (via drill 0.61)
  Top 0.305: U1.26 28.59,58.43 29.84,59.69 v41.91,59.69 v45.72,59.69 | v40.64,25.56 41.59,24.61 D1.1
  Bottom 0.305: v41.91,59.69 41.91,42.23 41.75,42.07 CN1.9 41.75,26.67 v40.64,25.56 | v45.72,59.69 45.72,66.04 JP8.3
DTR
  Top 0.305: C2.2 37.73,18.15 38.1,17.78 JP9.1
  Top 1.27: JP1.1 JP9.1
GND  (via drill 0.61)
  Top 0.305: U2.17 40.34,33 40.96,33.02 | 40.96,33.02 40.96,31.68 40.32,31.05 U2.20 | 40.64,34.92 40.62,34.95 U2.14 37.95,34.92 36.83,34.92 36.2,35.56 34.29,35.56 33.87,35.14 C12.1 33.81,34.08 33.81,34.13 33.5,33.81 33.5,31.91 33.97,31.43 | 27.3,38.1 23.5,38.1 23.18,38.42 22.54,38.42 22.44,38.52 22.44,38.84 | 31.11,38.73 30.48,38.1 27.3,38.1 | Q1.2 27.3,38.1 | C11.1 34.02,31.38 33.97,31.43 | 33.81,31.43 33.97,31.43 | 30.48,11.75 U3.2 30.48,17.78 31.11,18.41 31.11,21.27 31.75,21.91 32.89,21.91 C4.C | 30.48,11.75 U3.4 30.16,9.28 30.16,7.62 | LED2.C1 53.98,8.26 52.07,10.16 JP1.6 JP1.5 48.26,8.89 46.99,7.62 30.16,7.62 | C13.1 C14.1 43.18,28.63 43.18,30.8 44.08,31.7 U2.2 U2.3 U2.4 46.17,33 46.35,33.18 46.35,34.77 46.17,34.95 U2.7 U2.8 41.95,35.6 40.96,34.61 | 40.96,33.02 40.96,34.61 | 40.96,34.61 40.64,34.92 | 40.64,34.92 39.69,34.92 v39.69,35.88 | v45.72,40.32 45.24,40.8 v39.69,40.8 35.08,40.8 32.7,38.42 C9.2 32.38,37.78 30.16,35.56 v29.69,35.56 29.69,35.08 26.99,32.38 26.99,23.5 | S1.3 10.79,8.89 12.06,10.16 13.97,10.16 14.92,9.21 16.83,9.21 17.46,9.84 17.46,12.22 JP2.1 17.46,12.64 17.46,16.83 | v14.92,24.45 15.56,23.81 R1.1 16.25,23.44 17.78,21.91 17.78,20.32 17.78,18.1 17.46,17.78 17.46,16.88 C8.1 | v10.16,45.72 13.97,49.53 17.41,49.53 C15.1 17.52,49.53 18.41,49.53 19.68,50.8 U1.39 | v10.16,45.72 8.92,44.48 JP7.GND@1 6.99,43.18 6.37,42.56 JP7.GND@0 | v10.16,45.72 12.06,43.81 v12.06,39.37 | U1.28 26.99,59.37 27.57,59.95 C1.1 27.57,64.72 28.89,66.04 J1.6 | 36.46,52.7 C3.1 | 36.46,52.7 37.15,52.7 38.1,51.75 v39.37,51.75 | 36.46,52.7 35.24,52.7 34.14,51.6 U1.18 29.36,51.6 v28.57,52.39
  Top 0.305: U1.6 26.99,46.35 v28.57,47.94 | X2.GND 30.19,4.73 30.16,4.6 | 30,9.05 30.16,9.21 29.88,9.49 29.84,9.21 30.16,8.89 | v49.53,25.24 52.55,25.24 53.67,26.36 54.93,26.36 JP7.GND@2 | 22.12,38.42 C10.2 | Q2.2 21.91,28.89 22.54,28.26 22.54,26.67 25.72,23.5 26.99,23.5 | C5.C 27.94,23.18 27.62,23.5 26.99,23.5 | C6.2 v25.4,11.75 30.48,11.75 | R4.1 44.03,18.15 44.93,19.05 48.9,19.05 50.8,17.14 JP9.6 | C8.1 17.41,16.46 17.46,16.83 | C8.1 17.46,16.83 | 17.46,16.83 18.73,16.83 v20.95,14.61 21.91,15.56 C7.1 | 30.16,7.62 30.16,6.51
  Top 0.406: 31.11,38.73 32.28,38.73 C9.2 | C10.2 22.44,38.84
  Top 0.508: 29.88,9.49 30.37,9.49 U3.4
  Top 0.559: 15.24,20.32 U4.2 17.78,20.32
  Top 0.94: 30.16,4.6 30.16,6.51
  Top 1.27: JP9.5 JP1.5 | JP9.6 JP1.6
  Bottom 0.305: CN1.2 48.75,25.86 v49.53,25.24 54.93,19.84 54.93,13.02 52.07,10.16 JP1.6 | CN1.2 CN1.1 | CN1.2 CN1.3 | CN1.3 CN1.4 CN1.5 | CN1.3 47.75,36.07 45.72,38.1 v45.72,40.32 | v39.69,35.88 v39.69,40.8 39.37,40.96 v39.37,51.75 | CN1.37 CN1.36 CN1.35 CN1.34 | CN1.34 16.75,26.27 v14.92,24.45 | v25.4,11.75 23.81,11.75 v20.95,14.61 | CN1.34 16.75,32.15 15.88,33.02 13.97,33.02 12.06,34.92 v12.06,39.37 | J1.6 22.86,66.04 v21.59,64.77 10.16,53.34 v10.16,45.72 | v28.57,47.94 v28.57,52.39 | CN1.22 28.75,34.47 v29.69,35.56
  pour Top: 3.81,0 3.81,72.39 63.5,72.39 63.5,0
  pour Bottom: 0,0 0,72.39 59.69,72.39 59.69,0
IOREF
  Top 0.305: JP4.1 14,30.48 SJ3.2
L1  (via drill 0.61)
  Top 0.305: R11.2 28.26,24.77 v29.21,25.72
  Bottom 0.305: CN1.17 33.75,27.08 32.07,25.4 29.53,25.4 v29.21,25.72
L2  (via drill 0.61)
  Top 0.305: R12.2 30.96,26.99 v31.27,26.67
  Bottom 0.305: CN1.18 32.75,27.35 32.07,26.67 v31.27,26.67
L3  (via drill 0.61)
  Top 0.305: v29.69,33.02 29.53,33.02 28.57,32.07 R13.2
  Bottom 0.305: CN1.19 31.75,31.43 30.16,33.02 v29.69,33.02
L4  (via drill 0.61)
  Top 0.305: v29.69,31.43 29.69,30.32 28.57,29.21 R14.2
  Bottom 0.305: CN1.20 30.75,30.84 30.16,31.43 v29.69,31.43
LCD_RES
  Bottom 0.305: CN1.31 19.75,25.02 23.18,21.59 35.56,21.59 39.24,17.91 SJ2.2
N$1
  Top 0.305: U1.8 28.59,40.51 | 30.48,39.69 31.11,40.32 32.28,40.32
  Top 0.406: Q3.2 28.66,39.69 Q1.1 | 28.59,40.51 Q3.2 | Q3.2 30.48,39.69 | 32.28,40.32 C9.1
N$2
  Top 0.305: U1.7 27.79,43.34 25.72,41.27 25.72,40.23 | Q3.1 24.13,39.69 23.5,40.32 22.33,40.32
  Top 0.406: 25.72,40.23 Q1.3 25.36,39.85 Q3.1 | 22.33,40.32 C10.1
N$3
  Top 0.305: JP7.D11 56.36,34.29 55.09,35.56 51.12,35.56 49.85,34.29 SJ4.1
N$4
  Top 0.305: R8.1 20.59,32.76 20.95,32.38 20.95,30.84 Q2.1
N$5
  Top 0.305: LED2.A1 R5.1 | R5.1 56.83,9.21 56.46,9.26 R5.1
N$6
  Top 0.305: R7.1 39.37,28.89 44.13,33.66 U2.5
N$7
  Top 0.406: R13.1 R14.1 R12.1 R11.1
  Top 0.508: Q2.3 26.04,29.84 R14.1
N$8  (via drill 0.61)
  Top 0.305: R3.1 14.13,17.94 v13.97,17.78
  Bottom 0.305: v13.97,17.78 11.11,14.92 11.11,9.21 6.99,5.08 LED1.C1
N$9  (via drill 0.9)
  Top 0.305: R4.2 42.97,20.16 42.86,20 42.55,20.32 v41.43,20.32 40.64,21.11 D1.3
  Bottom 0.305: SJ2.1 40.96,19.84 v41.43,20.32
N$10
  Top 0.305: JP7.D13 56.36,29.21 55.09,30.48 50.48,30.48 49.53,29.53 SJ5.1
N$12
  Top 0.305: R3.2 16.43,21.22 U4.1
N$13
  Top 0.61: U4.5 19.08,22.78 R1.2
N$14
  Top 0.305: JP7.D12 SJ6.1
RES  (via drill 0.61)
  Top 0.305: S1.1 5.71,10.79 7.62,12.7 v7.62,14.92 | v11.75,19.05 11.75,20.95 v13.97,23.18 | 7.94,33.02 JP7.RES 9.53,33.02 10.79,31.75 v15.24,31.75 | U1.4 25.39,43.8 24.13,42.55 17.46,42.55 v15.56,40.64 15.19,40.59 R2.1 | v35.24,20.32 36.46,20.32 C2.1
  Bottom 0.305: 34.99,20.54 v35.24,20.32 | v35.24,20.32 34.92,20.64 22.54,20.64 20,23.18 v13.97,23.18 11.43,23.18 8.57,25.72 8.57,30.48 9.84,31.75 10.48,31.75 | v35.24,20.32 38.35,16.89 SJ2.3 | v7.62,14.92 v11.75,19.05 | J1.5 28.26,63.5 14.29,49.85 14.29,40.64 | 14.29,40.64 v15.56,40.64 | 14.29,40.64 11.43,40.64 10.48,39.69 10.48,31.75 | 10.48,31.75 v15.24,31.75
V+  (via drill 0.61)
  Top 1.016: 32.7,15.24 33.02,15.24 | 33.02,15.24 33.97,15.24 v34.92,14.29 | C4.A 32.79,19.01 U3.1 32.79,15.47 33.02,15.24
  Bottom 1.016: v34.92,14.29 26.67,14.29 20.64,20.32 JP5.2
VBAT
  Top 0.305: U4.3 16.8,19.24 16.57,19.14 | C8.2 15.61,15.78 15.51,15.56
  Top 1.016: 16.57,19.14 15.93,19.14 15.51,18.8 15.51,15.56 | JP2.2 15.51,15.56 | JP5.1 10.48,17.78 12.06,16.19 15.56,16.19 15.56,15.56 15.51,15.56
VUSB  (via drill 0.61)
  Top 0.305: X2.VBUS 26.88,5.19 26.99,4.6 | U4.4 19.08,19.08 | 19.08,19.08 19.05,19.21 | LED1.A1 20.64,3.81 22.86,6.03 26.67,6.03 26.99,6.35 26.99,7.3 | 19.08,19.08 20.56,19.08 | C7.2 23.5,19 23.5,16.19
  Top 0.813: 26.99,4.6 26.99,4.76
  Top 0.94: 19.05,19.21 23.5,19.21 | 26.99,4.76 26.99,7.3 23.5,10.79 23.5,16.19 23.5,19.21 | JP5.3 11.11,22.86 14.29,26.04 18.73,26.04 23.5,21.27 23.5,19.21
  Top 1.016: JP7.5V v6.35,38.1
  Bottom 1.016: v6.35,38.1 6.35,25.72 7.62,24.45 JP5.3
X+  (via drill 0.61)
  Top 0.305: U2.18 39.41,32.35 v39.69,32.07
  Bottom 0.305: CN1.12 38.75,31.13 39.37,31.75 v39.69,32.07
X-  (via drill 0.61)
  Top 0.305: U2.19 37.04,31.7 v36.14,32.59 | 35.88,32.38 v36.14,32.59 | R7.2 36.83,28.57 35.88,29.53 35.88,30.8 | 35.88,30.8 35.88,32.38 35.93,32.38 v36.14,32.59 | C11.2 35.88,30.8
  Top 0.406: 35.56,31.06 C11.2
  Bottom 0.305: CN1.14 36.75,31.99 v36.14,32.59
Y+  (via drill 0.61)
  Top 0.305: U2.15 39.38,34.3 v39.69,33.97
  Bottom 0.305: CN1.13 37.75,32.03 v39.69,33.97
Y-  (via drill 0.61)
  Top 0.305: C12.2 35.88,33.97 | U2.16 36.2,33.65 35.88,33.97 | 35.88,33.97 35.56,34.13 34.4,32.97 v34.4,32.6
  Bottom 0.305: v34.4,32.6 35.75,31.24 CN1.15

### Text on the board
tPlace: TouScruino-avr-ui2 | A7 | v0 | D21 | D22 | D23 | A6 | RX | A5 | TX | A4 | D2 | A3 | D3 | A2 | D4 | A1 | ~D5 | A0 | ~D6 | D7 | GND | D8 | GND | ~D9 | 3V3 | 5V | BL | D17 | D15 | ~D10 | D5 | 3.3V | D18 | D16 | D14 | MOSI | D11 | MISO | RST | D12 | IOREF | SCK | D13 | GND | AREF | 5V | SDA | LCD / RST | V+ | SCL | BAT | RST | Arduino prog. | DTR | TX | RX | 3.3V | GND | GND | CHARGE | L